# Altium project PCB_Project.PrjPcb (part 1 of 10)
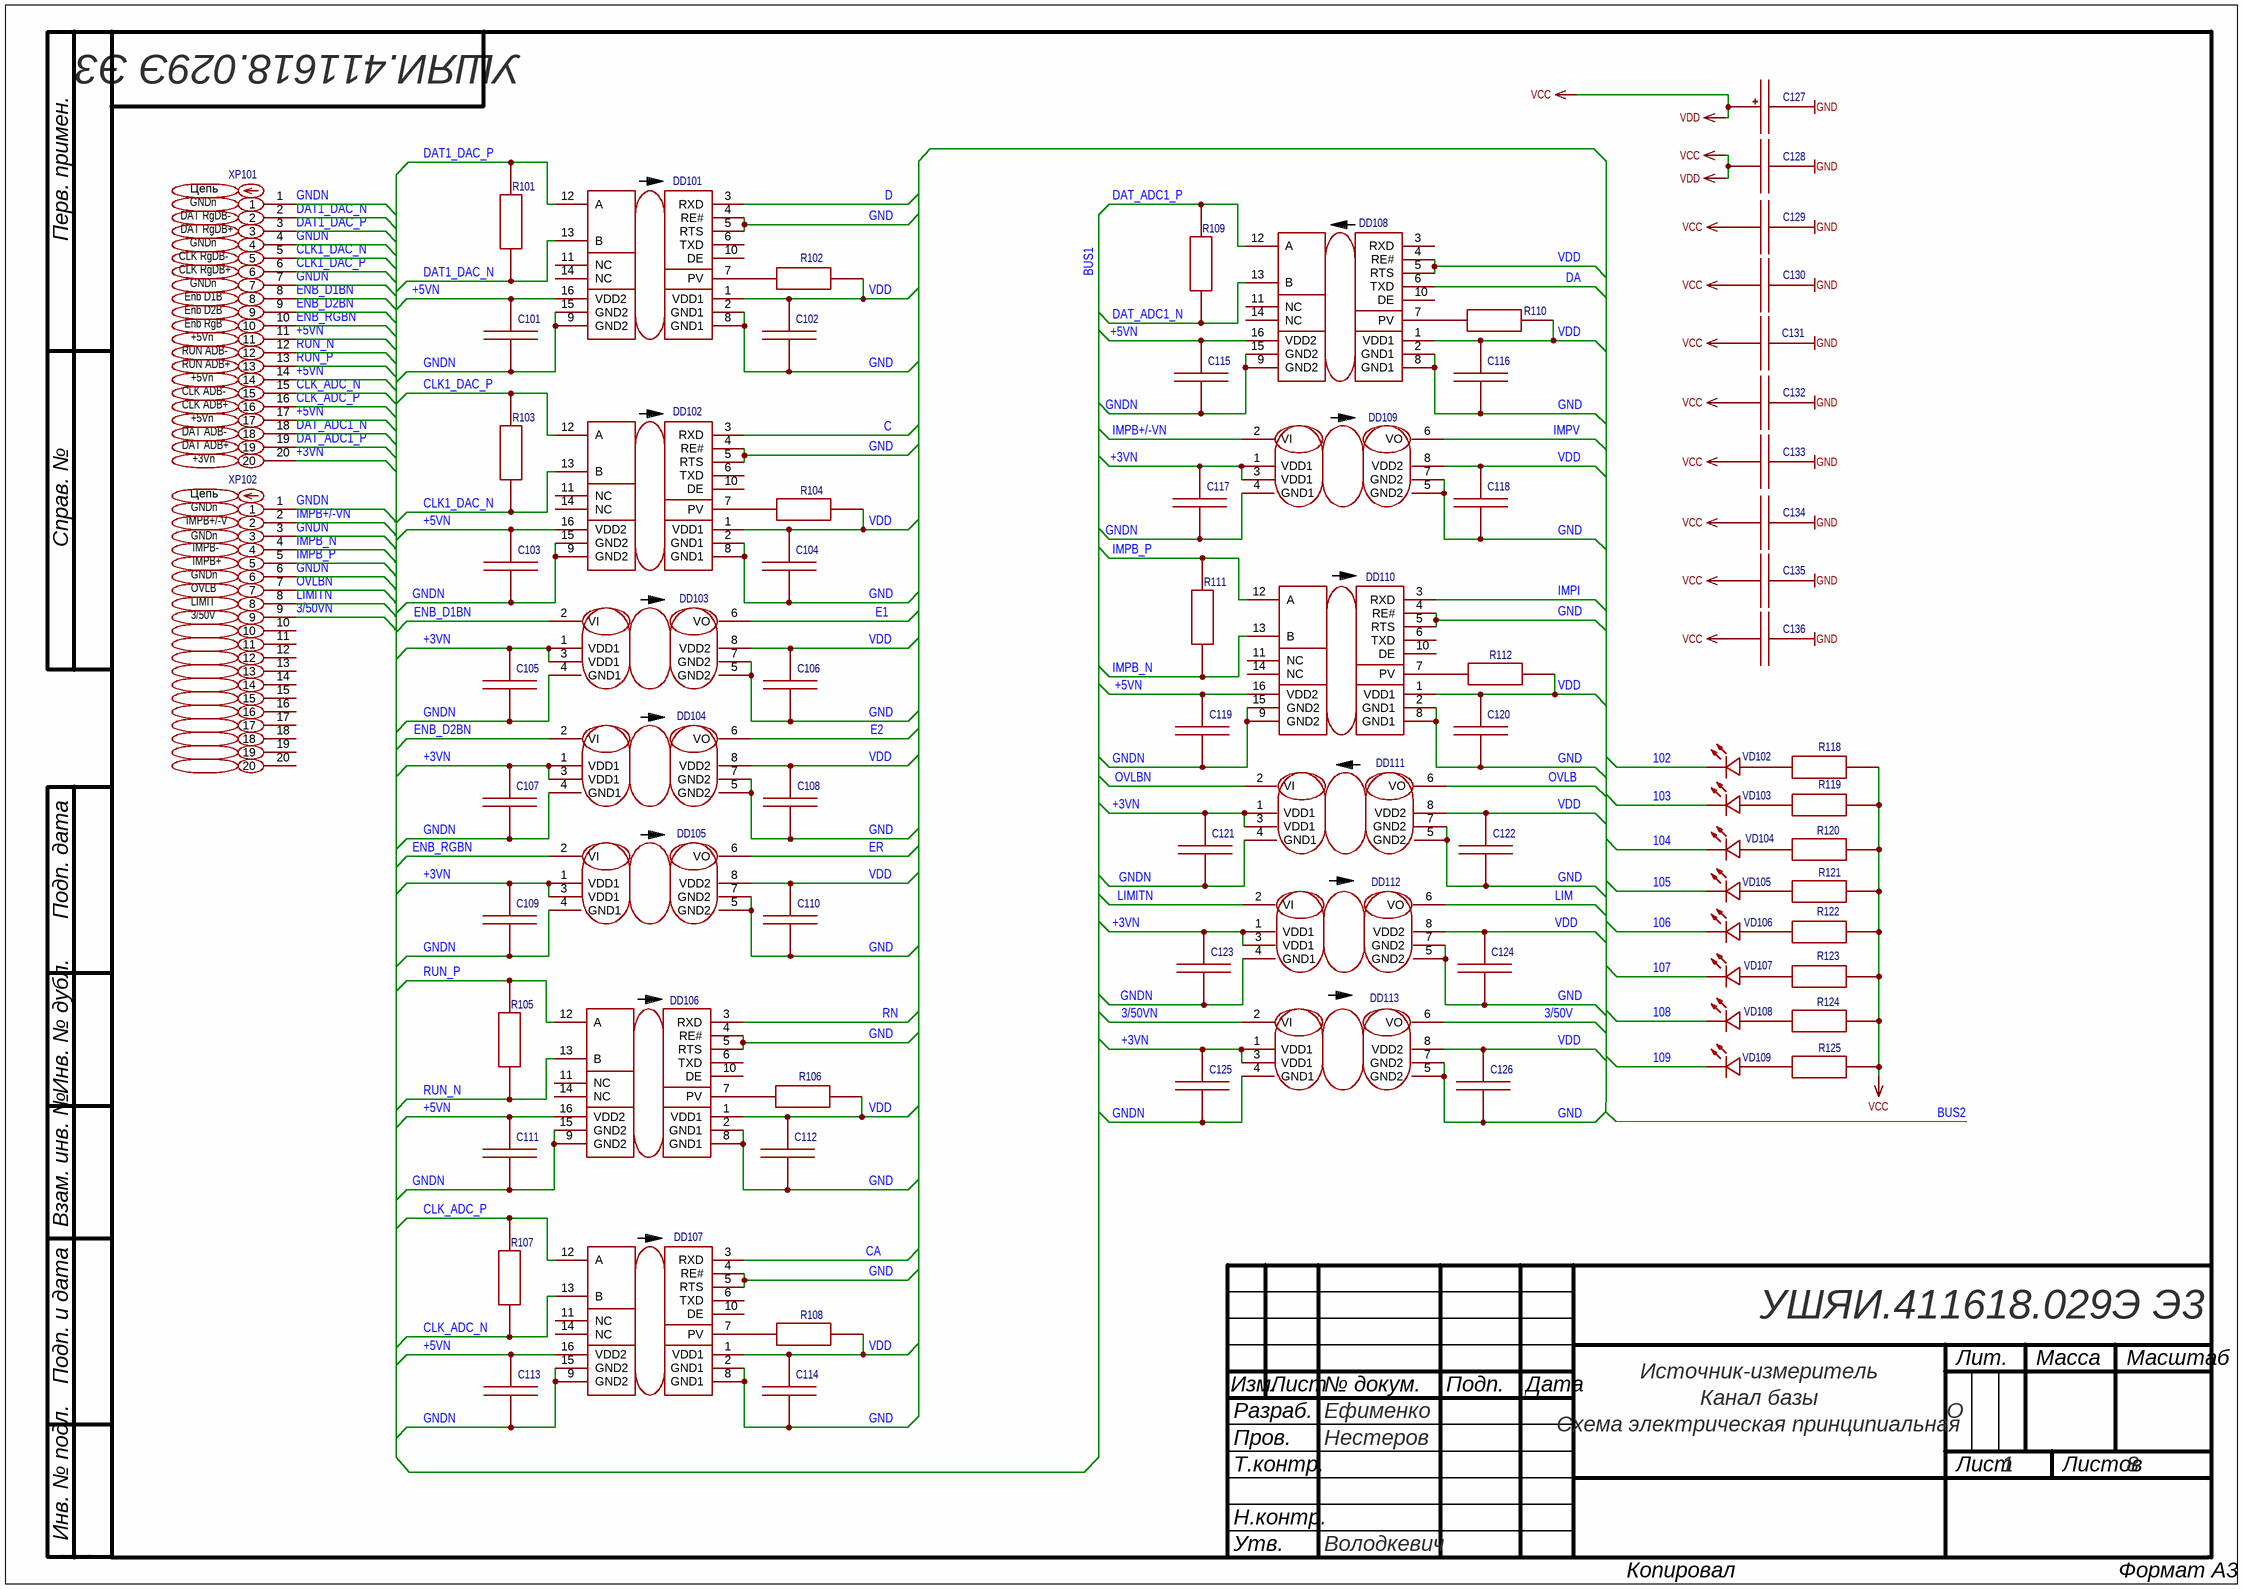
[diagram p0: УШЯИ.411618.029Э Э3 Лист 1.schdoc]
Литера: О; Наименование1: Источник-измеритель; Наименование2: Канал базы; Наименование3: Схема электрическая принципиальная; Обозначение_Код: УШЯИ.411618.029Э Э3; п_Пров_Р: Нестеров; п_Разраб: Ефименко; п_Разраб_Р: Ефименко; п_Утв_Р: Володкевич
7 sheets, 562 parts. Net scope: global (net labels, ports and power ports of the same name join across sheets).
Board file: УШЯИ.411618.029Э.pcbdoc
Sheets:
  УШЯИ.411618.029Э Э3 Лист 1.schdoc
  УШЯИ.411618.029Э Э3 Лист 2.schdoc
  УШЯИ.411618.029Э Э3 Лист 3.schdoc
  УШЯИ.411618.029Э Э3 Лист 4.schdoc
  УШЯИ.411618.029Э Э3 Лист 5.schdoc
  УШЯИ.411618.029Э Э3 Лист 6.schdoc
  УШЯИ.411618.029Э Э3 Лист 7.schdoc

## Sheet УШЯИ.411618.029Э Э3 Лист 1.schdoc
size 420 x 297 mm; ApprovedBy: Володкевич; CheckedBy: Нестеров; Author: Ефименко; CompanyName: ОАО "МНИПИ"; DrawnBy: Ефименко; Engineer: Ефименко; Organization: ОАО "МНИПИ"; DocumentNumber: УШЯИ.411618.029Э; SheetNumber: 1; SheetTotal: 8

### Parts
C101  Конденсатор SMD 100нФ 100В X7R 10% [0805]  [C0805]  (value not drawn)
C102  Конденсатор SMD 100нФ 100В X7R 10% [0805]  [C0805]  (value not drawn)
C103  Конденсатор SMD 100нФ 100В X7R 10% [0805]  [C0805]  (value not drawn)
C104  Конденсатор SMD 100нФ 100В X7R 10% [0805]  [C0805]  (value not drawn)
C105  Конденсатор SMD 100нФ 100В X7R 10% [0805]  [C0805]  (value not drawn)
C106  Конденсатор SMD 100нФ 100В X7R 10% [0805]  [C0805]  (value not drawn)
C107  Конденсатор SMD 100нФ 100В X7R 10% [0805]  [C0805]  (value not drawn)
C108  Конденсатор SMD 100нФ 100В X7R 10% [0805]  [C0805]  (value not drawn)
C109  Конденсатор SMD 100нФ 100В X7R 10% [0805]  [C0805]  (value not drawn)
C110  Конденсатор SMD 100нФ 100В X7R 10% [0805]  [C0805]  (value not drawn)
C111  Конденсатор SMD 100нФ 100В X7R 10% [0805]  [C0805]  (value not drawn)
C112  Конденсатор SMD 100нФ 100В X7R 10% [0805]  [C0805]  (value not drawn)
C113  Конденсатор SMD 100нФ 100В X7R 10% [0805]  [C0805]  (value not drawn)
C114  Конденсатор SMD 100нФ 100В X7R 10% [0805]  [C0805]  (value not drawn)
C115  Конденсатор SMD 100нФ 100В X7R 10% [0805]  [C0805]  (value not drawn)
C116  Конденсатор SMD 100нФ 100В X7R 10% [0805]  [C0805]  (value not drawn)
C117  Конденсатор SMD 100нФ 100В X7R 10% [0805]  [C0805]  (value not drawn)
C118  Конденсатор SMD 100нФ 100В X7R 10% [0805]  [C0805]  (value not drawn)
C119  Конденсатор SMD 100нФ 100В X7R 10% [0805]  [C0805]  (value not drawn)
C120  Конденсатор SMD 100нФ 100В X7R 10% [0805]  [C0805]  (value not drawn)
C121  Конденсатор SMD 100нФ 100В X7R 10% [0805]  [C0805]  (value not drawn)
C122  Конденсатор SMD 100нФ 100В X7R 10% [0805]  [C0805]  (value not drawn)
C123  Конденсатор SMD 100нФ 100В X7R 10% [0805]  [C0805]  (value not drawn)
C124  Конденсатор SMD 100нФ 100В X7R 10% [0805]  [C0805]  (value not drawn)
C125  Конденсатор SMD 100нФ 100В X7R 10% [0805]  [C0805]  (value not drawn)
C126  Конденсатор SMD 100нФ 100В X7R 10% [0805]  [C0805]  (value not drawn)
C127  TECAP, 100мкФ, 10В, тип C  [CASE-C_6032]  (value not drawn)
C128  Конденсатор SMD 10мкФ 100В X7R 10% [0805]  [C0805]  (value not drawn)
C129  Конденсатор SMD 100нФ 100В X7R 10% [0805]  [C0805]  (value not drawn)
C130  Конденсатор SMD 100нФ 100В X7R 10% [0805]  [C0805]  (value not drawn)
C131  Конденсатор SMD 100нФ 100В X7R 10% [0805]  [C0805]  (value not drawn)
C132  Конденсатор SMD 100нФ 100В X7R 10% [0805]  [C0805]  (value not drawn)
C133  Конденсатор SMD 100нФ 100В X7R 10% [0805]  [C0805]  (value not drawn)
C134  Конденсатор SMD 100нФ 100В X7R 10% [0805]  [C0805]  (value not drawn)
C135  Конденсатор SMD 100нФ 100В X7R 10% [0805]  [C0805]  (value not drawn)
C136  Конденсатор SMD 100нФ 100В X7R 10% [0805]  [C0805]  (value not drawn)
DD101  Изолированный приемопередатчик ADM2486BRWZ-REEL [SOIC-16]  [SOIC-16_L10.3-W7.5-P1.27-LS10.3-BL]  (value not drawn)
DD102  Изолированный приемопередатчик ADM2486BRWZ-REEL [SOIC-16]  [SOIC-16_L10.3-W7.5-P1.27-LS10.3-BL]  (value not drawn)
DD103  Высокоскоростной цифровой изолятор ADUM1100BRZ-RL7 [SOIC-8]  [SOIC-8_L4.9-W3.9-P1.27-LS6.0-BL]  (value not drawn)
DD104  Высокоскоростной цифровой изолятор ADUM1100BRZ-RL7 [SOIC-8]  [SOIC-8_L4.9-W3.9-P1.27-LS6.0-BL]  (value not drawn)
DD105  Высокоскоростной цифровой изолятор ADUM1100BRZ-RL7 [SOIC-8]  [SOIC-8_L4.9-W3.9-P1.27-LS6.0-BL]  (value not drawn)
DD106  Изолированный приемопередатчик ADM2486BRWZ-REEL [SOIC-16]  [SOIC-16_L10.3-W7.5-P1.27-LS10.3-BL]  (value not drawn)
DD107  Изолированный приемопередатчик ADM2486BRWZ-REEL [SOIC-16]  [SOIC-16_L10.3-W7.5-P1.27-LS10.3-BL]  (value not drawn)
DD108  Изолированный приемопередатчик ADM2486BRWZ-REEL [SOIC-16]  [SOIC-16_L10.3-W7.5-P1.27-LS10.3-BL]  (value not drawn)
DD109  Высокоскоростной цифровой изолятор ADUM1100BRZ-RL7 [SOIC-8]  [SOIC-8_L4.9-W3.9-P1.27-LS6.0-BL]  (value not drawn)
DD110  Изолированный приемопередатчик ADM2486BRWZ-REEL [SOIC-16]  [SOIC-16_L10.3-W7.5-P1.27-LS10.3-BL]  (value not drawn)
DD111  Высокоскоростной цифровой изолятор ADUM1100BRZ-RL7 [SOIC-8]  [SOIC-8_L4.9-W3.9-P1.27-LS6.0-BL]  (value not drawn)
DD112  Высокоскоростной цифровой изолятор ADUM1100BRZ-RL7 [SOIC-8]  [SOIC-8_L4.9-W3.9-P1.27-LS6.0-BL]  (value not drawn)
DD113  Высокоскоростной цифровой изолятор ADUM1100BRZ-RL7 [SOIC-8]  [SOIC-8_L4.9-W3.9-P1.27-LS6.0-BL]  (value not drawn)
R101  Резистор 100Ом 0,125Вт 1% [0805]  [R0805]  (value not drawn)
R102  Резистор 12кОм 0,125Вт 1% [0805]  [R0805]  (value not drawn)
R103  Резистор 100Ом 0,125Вт 1% [0805]  [R0805]  (value not drawn)
R104  Резистор 12кОм 0,125Вт 1% [0805]  [R0805]  (value not drawn)
R105  Резистор 100Ом 0,125Вт 1% [0805]  [R0805]  (value not drawn)
R106  Резистор 12кОм 0,125Вт 1% [0805]  [R0805]  (value not drawn)
R107  Резистор 100Ом 0,125Вт 1% [0805]  [R0805]  (value not drawn)
R108  Резистор 12кОм 0,125Вт 1% [0805]  [R0805]  (value not drawn)
R109  Резистор 100Ом 0,125Вт 1% [0805]  [R0805]  (value not drawn)
R110  Резистор 12кОм 0,125Вт 1% [0805]  [R0805]  (value not drawn)
R111  Резистор 100Ом 0,125Вт 1% [0805]  [R0805]  (value not drawn)
R112  Резистор 12кОм 0,125Вт 1% [0805]  [R0805]  (value not drawn)
R118  Резистор 100Ом 0,125Вт 1% [0805]  [R0805]  (value not drawn)
R119  Резистор 100Ом 0,125Вт 1% [0805]  [R0805]  (value not drawn)
R120  Резистор 100Ом 0,125Вт 1% [0805]  [R0805]  (value not drawn)
R121  Резистор 100Ом 0,125Вт 1% [0805]  [R0805]  (value not drawn)
R122  Резистор 100Ом 0,125Вт 1% [0805]  [R0805]  (value not drawn)
R123  Резистор 100Ом 0,125Вт 1% [0805]  [R0805]  (value not drawn)
R124  Резистор 100Ом 0,125Вт 1% [0805]  [R0805]  (value not drawn)
R125  Резистор 100Ом 0,125Вт 1% [0805]  [R0805]  (value not drawn)
VD102  Светодиод FYLS-0805GC [0805]  [FYLS-0805GC]  (value not drawn)
VD103  Светодиод FYLS-0805GC [0805]  [FYLS-0805GC]  (value not drawn)
VD104  Светодиод FYLS-0805GC [0805]  [FYLS-0805GC]  (value not drawn)
VD105  Светодиод FYLS-0805GC [0805]  [FYLS-0805GC]  (value not drawn)
VD106  Светодиод FYLS-0805GC [0805]  [FYLS-0805GC]  (value not drawn)
VD107  Светодиод FYLS-0805GC [0805]  [FYLS-0805GC]  (value not drawn)
VD108  Светодиод FYLS-0805GC [0805]  [FYLS-0805GC]  (value not drawn)
VD109  Светодиод FYLS-0805GC [0805]  [FYLS-0805GC]  (value not drawn)
XP101  Вилка на плату прямая BH2-20 (DS1014-20SF1B-B) 20pin шаг 2.00мм  [CONN-TH_20P-P2.00_DS1014-20SF1B]  (value not drawn)
XP102  Вилка на плату прямая BH2-20 (DS1014-20SF1B-B) 20pin шаг 2.00мм  [CONN-TH_20P-P2.00_DS1014-20SF1B]  (value not drawn)

### Nets
GND: C102.1 C104.1 C106.1 C108.1 C110.1 C112.1 C114.1 C116.1 C118.1 C120.1 C122.1 C124.1 C126.1 C127.2 C128.1 C129.2 C130.2 C131.2 C132.2 C133.2 C134.2 C135.2 C136.2 DD101.2(GND1) DD101.4(RE#) DD101.5(RTS) DD101.8(GND1) DD102.2(GND1) DD102.4(RE#) DD102.5(RTS) DD102.8(GND1) DD103.5(GND2) DD103.7(GND2) DD104.5(GND2) DD104.7(GND2) DD105.5(GND2) DD105.7(GND2) DD106.2(GND1) DD106.4(RE#) DD106.5(RTS) DD106.8(GND1) DD107.2(GND1) DD107.4(RE#) DD107.5(RTS) DD107.8(GND1) DD108.2(GND1) DD108.8(GND1) DD109.5(GND2) DD109.7(GND2) DD110.2(GND1) DD110.4(RE#) DD110.5(RTS) DD110.8(GND1) DD111.5(GND2) DD111.7(GND2) DD112.5(GND2) DD112.7(GND2) DD113.5(GND2) DD113.7(GND2)
VDD: C102.2 C104.2 C106.2 C108.2 C110.2 C112.2 C114.2 C116.2 C118.2 C120.2 C122.2 C124.2 C126.2 C127.1 C128.2 C129.1 C130.1 C131.1 C132.1 C133.1 C134.1 C135.1 C136.1 DD101.1(VDD1) DD102.1(VDD1) DD103.8(VDD2) DD104.8(VDD2) DD105.8(VDD2) DD106.1(VDD1) DD107.1(VDD1) DD108.1(VDD1) DD108.4(RE#) DD108.5(RTS) DD109.8(VDD2) DD110.1(VDD1) DD111.8(VDD2) DD112.8(VDD2) DD113.8(VDD2) R102.1 R104.1 R106.1 R108.1 R110.1 R112.1 R118.1 R119.1 R120.1 R121.1 R122.1 R123.1 R124.1 R125.1  [also labelled VCC]
3/50V: DD113.6(VO)
3/50VN: DD113.2(VI) XP102.9
102: VD102.1(K)
103: VD103.1(K)
104: VD104.1(K)
105: VD105.1(K)
106: VD106.1(K)
107: VD107.1(K)
108: VD108.1(K)
109: VD109.1(K)
+3VN: C105.2 C107.2 C109.2 C117.2 C121.2 C123.2 C125.2 DD103.1(VDD1) DD103.3(VDD1) DD104.1(VDD1) DD104.3(VDD1) DD105.1(VDD1) DD105.3(VDD1) DD109.1(VDD1) DD109.3(VDD1) DD111.1(VDD1) DD111.3(VDD1) DD112.1(VDD1) DD112.3(VDD1) DD113.1(VDD1) DD113.3(VDD1) XP101.20
+5VN: C101.2 C103.2 C111.2 C113.2 C115.2 C119.2 DD101.16(VDD2) DD102.16(VDD2) DD106.16(VDD2) DD107.16(VDD2) DD108.16(VDD2) DD110.16(VDD2) XP101.11 XP101.14 XP101.17
C: DD102.3(RXD)
CA: DD107.3(RXD)
CLK1_DAC_N: DD102.13(B) R103.2 XP101.5
CLK1_DAC_P: DD102.12(A) R103.1 XP101.6
CLK_ADC_N: DD107.13(B) R107.2 XP101.15
CLK_ADC_P: DD107.12(A) R107.1 XP101.16
D: DD101.3(RXD)
DA: DD108.6(TXD)
DAT1_DAC_N: DD101.13(B) R101.2 XP101.2
DAT1_DAC_P: DD101.12(A) R101.1 XP101.3
DAT_ADC1_N: DD108.13(B) R109.2 XP101.18
DAT_ADC1_P: DD108.12(A) R109.1 XP101.19
E1: DD103.6(VO)
E2: DD104.6(VO)
ENB_D1BN: DD103.2(VI) XP101.8
ENB_D2BN: DD104.2(VI) XP101.9
ENB_RGBN: DD105.2(VI) XP101.10
ER: DD105.6(VO)
GNDN: C101.1 C103.1 C105.1 C107.1 C109.1 C111.1 C113.1 C115.1 C117.1 C119.1 C121.1 C123.1 C125.1 DD101.9(GND2) DD101.15(GND2) DD102.9(GND2) DD102.15(GND2) DD103.4(GND1) DD104.4(GND1) DD105.4(GND1) DD106.9(GND2) DD106.15(GND2) DD107.9(GND2) DD107.15(GND2) DD108.9(GND2) DD108.15(GND2) DD109.4(GND1) DD110.9(GND2) DD110.15(GND2) DD111.4(GND1) DD112.4(GND1) DD113.4(GND1) XP101.1 XP101.4 XP101.7 XP102.1 XP102.3 XP102.6
IMPB+/-VN: DD109.2(VI) XP102.2
IMPB_N: DD110.13(B) R111.2 XP102.4
IMPB_P: DD110.12(A) R111.1 XP102.5
IMPI: DD110.3(RXD)
IMPV: DD109.6(VO)
LIM: DD112.6(VO)
LIMITN: DD112.2(VI) XP102.8
OVLB: DD111.6(VO)
OVLBN: DD111.2(VI) XP102.7
RN: DD106.3(RXD)
RUN_N: DD106.13(B) R105.2 XP101.12
RUN_P: DD106.12(A) R105.1 XP101.13
NetDD101_7: DD101.7(PV) R102.2
NetDD102_7: DD102.7(PV) R104.2
NetDD106_7: DD106.7(PV) R106.2
NetDD107_7: DD107.7(PV) R108.2
NetDD108_7: DD108.7(PV) R110.2
NetDD110_7: DD110.7(PV) R112.2
NetR118_2: R118.2 VD102.2(A)
NetR119_2: R119.2 VD103.2(A)
NetR120_2: R120.2 VD104.2(A)
NetR121_2: R121.2 VD105.2(A)
NetR122_2: R122.2 VD106.2(A)
NetR123_2: R123.2 VD107.2(A)
NetR124_2: R124.2 VD108.2(A)
NetR125_2: R125.2 VD109.2(A)

Not connected (* = marked no-connect by the designer): DD101 6(TXD) 10(DE) 11(NC) 14(NC); DD102 6(TXD) 10(DE) 11(NC) 14(NC); DD106 6(TXD) 10(DE) 11(NC) 14(NC); DD107 6(TXD) 10(DE) 11(NC) 14(NC); DD108 3(RXD) 10(DE) 11(NC) 14(NC); DD110 6(TXD) 10(DE) 11(NC) 14(NC); XP102 10 11 12 13 14 15 16 17 18 19 20

### Buses and harness runs
bus BUS2

### Notes on the sheet
- (near XP101) CLK RgDB-
- (near XP101) DAT RgDB-
- (near XP101) DAT RgDB+
- (near XP101) GNDn
- (near XP101) CLK RgDB+
- (near XP101) Enb D1B
- (near XP101) Enb D2B
- (near XP101) Enb RgB
- (near XP101) RUN ADB-
- (near XP101) RUN ADB+
- (near XP101) CLK ADB-
- (near XP101) +5Vn
- (near XP101) CLK ADB+
- (near XP101) DAT ADB-
- (near XP101) DAT ADB+
- +3Vn
- (near XP102) IMPB+/-V
- GNDn
- (near XP102) GNDn
- (near XP102) OVLB
- (near XP102) IMPB-
- (near XP102) IMPB+
- (near XP102) LIMIT
- (near XP102) 3/50V
- Labels drawn without touching a wire or pin: BUS1
- Перв. примен.
- Справ. №
- Подп. дата
- Инв. № дубл.
- Взам. инв. №
- Подп. и дата
- Изм.
- Разраб.
- Лист
- № докум.
- Подп.
- Дата
- Лит.
- Масса
- Масштаб
- Пров.
- Т.контр.
- Листов
- Инв. № подл.
- Н.контр.
- Утв.
- ALTIUM GOSTBOM2.0 KEV
- Копировал
- Формат А3
- (in symbol Вилка на плату прямая BH2-20 (DS1014-20SF1B-B) 20pin шаг 2.00мм) Цепь

### Library data of the parts
C101 = Конденсатор SMD 100нФ 100В X7R 10% [0805]: Contributor: jordanjin; Convert to PCB: yes; UniqueId: gge50a601ba36169810; Origin Footprint: C0805; Device: Конденсатор SMD 100нФ 100В X7R 10% [0805]; Symbol: Конденсатор SMD 100нФ 100В X7R 10% [0805]; Manufacturer Part: C0805; spicePre: C; spiceSymbolName: Конденсатор SMD 100нФ 100В X7R 10% [0805]; Add into BOM: yes; FootprintName: C0805
C102 = Конденсатор SMD 100нФ 100В X7R 10% [0805]: Contributor: jordanjin; Convert to PCB: yes; UniqueId: gge94e2ea0e3b3374a7; Origin Footprint: C0805; Device: Конденсатор SMD 100нФ 100В X7R 10% [0805]; Symbol: Конденсатор SMD 100нФ 100В X7R 10% [0805]; Manufacturer Part: C0805; spicePre: C; spiceSymbolName: Конденсатор SMD 100нФ 100В X7R 10% [0805]; Add into BOM: yes; FootprintName: C0805
C103 = Конденсатор SMD 100нФ 100В X7R 10% [0805]: Contributor: jordanjin; Convert to PCB: yes; UniqueId: ggedacb5201c4a5c4e2; Origin Footprint: C0805; Device: Конденсатор SMD 100нФ 100В X7R 10% [0805]; Symbol: Конденсатор SMD 100нФ 100В X7R 10% [0805]; Manufacturer Part: C0805; spicePre: C; spiceSymbolName: Конденсатор SMD 100нФ 100В X7R 10% [0805]; Add into BOM: yes; FootprintName: C0805
C104 = Конденсатор SMD 100нФ 100В X7R 10% [0805]: Contributor: jordanjin; Convert to PCB: yes; UniqueId: gge34eda7cf9e9ee0fb; Origin Footprint: C0805; Device: Конденсатор SMD 100нФ 100В X7R 10% [0805]; Symbol: Конденсатор SMD 100нФ 100В X7R 10% [0805]; Manufacturer Part: C0805; spicePre: C; spiceSymbolName: Конденсатор SMD 100нФ 100В X7R 10% [0805]; Add into BOM: yes; FootprintName: C0805
C105 = Конденсатор SMD 100нФ 100В X7R 10% [0805]: Contributor: jordanjin; Convert to PCB: yes; UniqueId: gge25c71510294cab0d; Origin Footprint: C0805; Device: Конденсатор SMD 100нФ 100В X7R 10% [0805]; Symbol: Конденсатор SMD 100нФ 100В X7R 10% [0805]; Manufacturer Part: C0805; spicePre: C; spiceSymbolName: Конденсатор SMD 100нФ 100В X7R 10% [0805]; Add into BOM: yes; FootprintName: C0805
C106 = Конденсатор SMD 100нФ 100В X7R 10% [0805]: Contributor: jordanjin; Convert to PCB: yes; UniqueId: gge49d087e124082ea0; Origin Footprint: C0805; Device: Конденсатор SMD 100нФ 100В X7R 10% [0805]; Symbol: Конденсатор SMD 100нФ 100В X7R 10% [0805]; Manufacturer Part: C0805; spicePre: C; spiceSymbolName: Конденсатор SMD 100нФ 100В X7R 10% [0805]; Add into BOM: yes; FootprintName: C0805
C107 = Конденсатор SMD 100нФ 100В X7R 10% [0805]: Contributor: jordanjin; Convert to PCB: yes; UniqueId: gge50cb57ab95e02ebe; Origin Footprint: C0805; Device: Конденсатор SMD 100нФ 100В X7R 10% [0805]; Symbol: Конденсатор SMD 100нФ 100В X7R 10% [0805]; Manufacturer Part: C0805; spicePre: C; spiceSymbolName: Конденсатор SMD 100нФ 100В X7R 10% [0805]; Add into BOM: yes; FootprintName: C0805
C108 = Конденсатор SMD 100нФ 100В X7R 10% [0805]: Contributor: jordanjin; Convert to PCB: yes; UniqueId: gged933a6a0350d5a04; Origin Footprint: C0805; Device: Конденсатор SMD 100нФ 100В X7R 10% [0805]; Symbol: Конденсатор SMD 100нФ 100В X7R 10% [0805]; Manufacturer Part: C0805; spicePre: C; spiceSymbolName: Конденсатор SMD 100нФ 100В X7R 10% [0805]; Add into BOM: yes; FootprintName: C0805
C109 = Конденсатор SMD 100нФ 100В X7R 10% [0805]: Contributor: jordanjin; Convert to PCB: yes; UniqueId: gge27962ba85defdf79; Origin Footprint: C0805; Device: Конденсатор SMD 100нФ 100В X7R 10% [0805]; Symbol: Конденсатор SMD 100нФ 100В X7R 10% [0805]; Manufacturer Part: C0805; spicePre: C; spiceSymbolName: Конденсатор SMD 100нФ 100В X7R 10% [0805]; Add into BOM: yes; FootprintName: C0805
C110 = Конденсатор SMD 100нФ 100В X7R 10% [0805]: Contributor: jordanjin; Convert to PCB: yes; UniqueId: gge612c97588fe9464b; Origin Footprint: C0805; Device: Конденсатор SMD 100нФ 100В X7R 10% [0805]; Symbol: Конденсатор SMD 100нФ 100В X7R 10% [0805]; Manufacturer Part: C0805; spicePre: C; spiceSymbolName: Конденсатор SMD 100нФ 100В X7R 10% [0805]; Add into BOM: yes; FootprintName: C0805
C111 = Конденсатор SMD 100нФ 100В X7R 10% [0805]: Contributor: jordanjin; Convert to PCB: yes; UniqueId: gge2f7a6f25e128a448; Origin Footprint: C0805; Device: Конденсатор SMD 100нФ 100В X7R 10% [0805]; Symbol: Конденсатор SMD 100нФ 100В X7R 10% [0805]; Manufacturer Part: C0805; spicePre: C; spiceSymbolName: Конденсатор SMD 100нФ 100В X7R 10% [0805]; Add into BOM: yes; FootprintName: C0805
C112 = Конденсатор SMD 100нФ 100В X7R 10% [0805]: Contributor: jordanjin; Convert to PCB: yes; UniqueId: gge7a76c4b2d63205ed; Origin Footprint: C0805; Device: Конденсатор SMD 100нФ 100В X7R 10% [0805]; Symbol: Конденсатор SMD 100нФ 100В X7R 10% [0805]; Manufacturer Part: C0805; spicePre: C; spiceSymbolName: Конденсатор SMD 100нФ 100В X7R 10% [0805]; Add into BOM: yes; FootprintName: C0805
C113 = Конденсатор SMD 100нФ 100В X7R 10% [0805]: Contributor: jordanjin; Convert to PCB: yes; UniqueId: gge1b835d6c60b435b0; Origin Footprint: C0805; Device: Конденсатор SMD 100нФ 100В X7R 10% [0805]; Symbol: Конденсатор SMD 100нФ 100В X7R 10% [0805]; Manufacturer Part: C0805; spicePre: C; spiceSymbolName: Конденсатор SMD 100нФ 100В X7R 10% [0805]; Add into BOM: yes; FootprintName: C0805
C114 = Конденсатор SMD 100нФ 100В X7R 10% [0805]: Contributor: jordanjin; Convert to PCB: yes; UniqueId: gged3422836171095bd; Origin Footprint: C0805; Device: Конденсатор SMD 100нФ 100В X7R 10% [0805]; Symbol: Конденсатор SMD 100нФ 100В X7R 10% [0805]; Manufacturer Part: C0805; spicePre: C; spiceSymbolName: Конденсатор SMD 100нФ 100В X7R 10% [0805]; Add into BOM: yes; FootprintName: C0805
C115 = Конденсатор SMD 100нФ 100В X7R 10% [0805]: Contributor: jordanjin; Convert to PCB: yes; UniqueId: gge559d8560901f254c; Origin Footprint: C0805; Device: Конденсатор SMD 100нФ 100В X7R 10% [0805]; Symbol: Конденсатор SMD 100нФ 100В X7R 10% [0805]; Manufacturer Part: C0805; spicePre: C; spiceSymbolName: Конденсатор SMD 100нФ 100В X7R 10% [0805]; Add into BOM: yes; FootprintName: C0805
C116 = Конденсатор SMD 100нФ 100В X7R 10% [0805]: Contributor: jordanjin; Convert to PCB: yes; UniqueId: ggec511750cb831a988; Origin Footprint: C0805; Device: Конденсатор SMD 100нФ 100В X7R 10% [0805]; Symbol: Конденсатор SMD 100нФ 100В X7R 10% [0805]; Manufacturer Part: C0805; spicePre: C; spiceSymbolName: Конденсатор SMD 100нФ 100В X7R 10% [0805]; Add into BOM: yes; FootprintName: C0805
C117 = Конденсатор SMD 100нФ 100В X7R 10% [0805]: Contributor: jordanjin; Convert to PCB: yes; UniqueId: gge492dbba8a9d90766; Origin Footprint: C0805; Device: Конденсатор SMD 100нФ 100В X7R 10% [0805]; Symbol: Конденсатор SMD 100нФ 100В X7R 10% [0805]; Manufacturer Part: C0805; spicePre: C; spiceSymbolName: Конденсатор SMD 100нФ 100В X7R 10% [0805]; Add into BOM: yes; FootprintName: C0805
C118 = Конденсатор SMD 100нФ 100В X7R 10% [0805]: Contributor: jordanjin; Convert to PCB: yes; UniqueId: ggedc3a872f3d7bf9b6; Origin Footprint: C0805; Device: Конденсатор SMD 100нФ 100В X7R 10% [0805]; Symbol: Конденсатор SMD 100нФ 100В X7R 10% [0805]; Manufacturer Part: C0805; spicePre: C; spiceSymbolName: Конденсатор SMD 100нФ 100В X7R 10% [0805]; Add into BOM: yes; FootprintName: C0805
C119 = Конденсатор SMD 100нФ 100В X7R 10% [0805]: Contributor: jordanjin; Convert to PCB: yes; UniqueId: ggea50e830354660b01; Origin Footprint: C0805; Device: Конденсатор SMD 100нФ 100В X7R 10% [0805]; Symbol: Конденсатор SMD 100нФ 100В X7R 10% [0805]; Manufacturer Part: C0805; spicePre: C; spiceSymbolName: Конденсатор SMD 100нФ 100В X7R 10% [0805]; Add into BOM: yes; FootprintName: C0805
C120 = Конденсатор SMD 100нФ 100В X7R 10% [0805]: Contributor: jordanjin; Convert to PCB: yes; UniqueId: gge9590b5d8379a1919; Origin Footprint: C0805; Device: Конденсатор SMD 100нФ 100В X7R 10% [0805]; Symbol: Конденсатор SMD 100нФ 100В X7R 10% [0805]; Manufacturer Part: C0805; spicePre: C; spiceSymbolName: Конденсатор SMD 100нФ 100В X7R 10% [0805]; Add into BOM: yes; FootprintName: C0805
C121 = Конденсатор SMD 100нФ 100В X7R 10% [0805]: Contributor: jordanjin; Convert to PCB: yes; UniqueId: gge63b3ddf0ade3641d; Origin Footprint: C0805; Device: Конденсатор SMD 100нФ 100В X7R 10% [0805]; Symbol: Конденсатор SMD 100нФ 100В X7R 10% [0805]; Manufacturer Part: C0805; spicePre: C; spiceSymbolName: Конденсатор SMD 100нФ 100В X7R 10% [0805]; Add into BOM: yes; FootprintName: C0805
C122 = Конденсатор SMD 100нФ 100В X7R 10% [0805]: Contributor: jordanjin; Convert to PCB: yes; UniqueId: ggeb83b43dba428f6ef; Origin Footprint: C0805; Device: Конденсатор SMD 100нФ 100В X7R 10% [0805]; Symbol: Конденсатор SMD 100нФ 100В X7R 10% [0805]; Manufacturer Part: C0805; spicePre: C; spiceSymbolName: Конденсатор SMD 100нФ 100В X7R 10% [0805]; Add into BOM: yes; FootprintName: C0805
C123 = Конденсатор SMD 100нФ 100В X7R 10% [0805]: Contributor: jordanjin; Convert to PCB: yes; UniqueId: ggea2a125f1a1054dbe; Origin Footprint: C0805; Device: Конденсатор SMD 100нФ 100В X7R 10% [0805]; Symbol: Конденсатор SMD 100нФ 100В X7R 10% [0805]; Manufacturer Part: C0805; spicePre: C; spiceSymbolName: Конденсатор SMD 100нФ 100В X7R 10% [0805]; Add into BOM: yes; FootprintName: C0805
C124 = Конденсатор SMD 100нФ 100В X7R 10% [0805]: Contributor: jordanjin; Convert to PCB: yes; UniqueId: gge87e42572fc320fa7; Origin Footprint: C0805; Device: Конденсатор SMD 100нФ 100В X7R 10% [0805]; Symbol: Конденсатор SMD 100нФ 100В X7R 10% [0805]; Manufacturer Part: C0805; spicePre: C; spiceSymbolName: Конденсатор SMD 100нФ 100В X7R 10% [0805]; Add into BOM: yes; FootprintName: C0805
C125 = Конденсатор SMD 100нФ 100В X7R 10% [0805]: Contributor: jordanjin; Convert to PCB: yes; UniqueId: ggea9bf1272ff874ec4; Origin Footprint: C0805; Device: Конденсатор SMD 100нФ 100В X7R 10% [0805]; Symbol: Конденсатор SMD 100нФ 100В X7R 10% [0805]; Manufacturer Part: C0805; spicePre: C; spiceSymbolName: Конденсатор SMD 100нФ 100В X7R 10% [0805]; Add into BOM: yes; FootprintName: C0805
C126 = Конденсатор SMD 100нФ 100В X7R 10% [0805]: Contributor: jordanjin; Convert to PCB: yes; UniqueId: ggec79572819af15c76; Origin Footprint: C0805; Device: Конденсатор SMD 100нФ 100В X7R 10% [0805]; Symbol: Конденсатор SMD 100нФ 100В X7R 10% [0805]; Manufacturer Part: C0805; spicePre: C; spiceSymbolName: Конденсатор SMD 100нФ 100В X7R 10% [0805]; Add into BOM: yes; FootprintName: C0805
C127 = TECAP, 100мкФ, 10В, тип C: Manufacturer: Kyocera AVX; nameAlias: Value; Contributor: jordanjin; Convert to PCB: yes; UniqueId: gge1274122329830bad; Origin Footprint: CASE-C_6032; Device: TECAP, 100мкФ, 10В, тип C; Symbol: TECAP, 100мкФ, 10В, тип C; Supplier: LCSC; Supplier Part: C273664; Manufacturer Part: TECAP, 100мкФ, 10В, тип C; JLCPCB Part Class: Extended Part; spicePre: C; spiceSymbolName: TECAP, 100мкФ, 10В, тип C; Add into BOM: yes; FootprintName: CASE-C_6032
C128 = Конденсатор SMD 10мкФ 100В X7R 10% [0805]: Contributor: jordanjin; Convert to PCB: yes; UniqueId: gge114f7bd3638c32e8; Origin Footprint: C0805; Device: Конденсатор SMD 10мкФ 100В X7R 10% [0805]; Symbol: Конденсатор SMD 10мкФ 100В X7R 10% [0805]; Manufacturer Part: C0805; spicePre: C; spiceSymbolName: Конденсатор SMD 100нФ 100В X7R 10% [0805]; Add into BOM: yes; FootprintName: C0805
C129 = Конденсатор SMD 100нФ 100В X7R 10% [0805]: Contributor: jordanjin; Convert to PCB: yes; UniqueId: ggeb629d3a449f0ebd6; Origin Footprint: C0805; Device: Конденсатор SMD 100нФ 100В X7R 10% [0805]; Symbol: Конденсатор SMD 100нФ 100В X7R 10% [0805]; Manufacturer Part: C0805; spicePre: C; spiceSymbolName: Конденсатор SMD 100нФ 100В X7R 10% [0805]; Add into BOM: yes; FootprintName: C0805
C130 = Конденсатор SMD 100нФ 100В X7R 10% [0805]: Contributor: jordanjin; Convert to PCB: yes; UniqueId: gge720601326cec92c7; Origin Footprint: C0805; Device: Конденсатор SMD 100нФ 100В X7R 10% [0805]; Symbol: Конденсатор SMD 100нФ 100В X7R 10% [0805]; Manufacturer Part: C0805; spicePre: C; spiceSymbolName: Конденсатор SMD 100нФ 100В X7R 10% [0805]; Add into BOM: yes; FootprintName: C0805
C131 = Конденсатор SMD 100нФ 100В X7R 10% [0805]: Contributor: jordanjin; Convert to PCB: yes; UniqueId: gge93f31df730ba0f33; Origin Footprint: C0805; Device: Конденсатор SMD 100нФ 100В X7R 10% [0805]; Symbol: Конденсатор SMD 100нФ 100В X7R 10% [0805]; Manufacturer Part: C0805; spicePre: C; spiceSymbolName: Конденсатор SMD 100нФ 100В X7R 10% [0805]; Add into BOM: yes; FootprintName: C0805
C132 = Конденсатор SMD 100нФ 100В X7R 10% [0805]: Contributor: jordanjin; Convert to PCB: yes; UniqueId: ggeb7d0df687c6811f3; Origin Footprint: C0805; Device: Конденсатор SMD 100нФ 100В X7R 10% [0805]; Symbol: Конденсатор SMD 100нФ 100В X7R 10% [0805]; Manufacturer Part: C0805; spicePre: C; spiceSymbolName: Конденсатор SMD 100нФ 100В X7R 10% [0805]; Add into BOM: yes; FootprintName: C0805
C133 = Конденсатор SMD 100нФ 100В X7R 10% [0805]: Contributor: jordanjin; Convert to PCB: yes; UniqueId: ggeda150ecc94310c71; Origin Footprint: C0805; Device: Конденсатор SMD 100нФ 100В X7R 10% [0805]; Symbol: Конденсатор SMD 100нФ 100В X7R 10% [0805]; Manufacturer Part: C0805; spicePre: C; spiceSymbolName: Конденсатор SMD 100нФ 100В X7R 10% [0805]; Add into BOM: yes; FootprintName: C0805
C134 = Конденсатор SMD 100нФ 100В X7R 10% [0805]: Contributor: jordanjin; Convert to PCB: yes; UniqueId: gge45b133ad58b3c6cc; Origin Footprint: C0805; Device: Конденсатор SMD 100нФ 100В X7R 10% [0805]; Symbol: Конденсатор SMD 100нФ 100В X7R 10% [0805]; Manufacturer Part: C0805; spicePre: C; spiceSymbolName: Конденсатор SMD 100нФ 100В X7R 10% [0805]; Add into BOM: yes; FootprintName: C0805
C135 = Конденсатор SMD 100нФ 100В X7R 10% [0805]: Contributor: jordanjin; Convert to PCB: yes; UniqueId: gge8cfa1b9352ccbfc1; Origin Footprint: C0805; Device: Конденсатор SMD 100нФ 100В X7R 10% [0805]; Symbol: Конденсатор SMD 100нФ 100В X7R 10% [0805]; Manufacturer Part: C0805; spicePre: C; spiceSymbolName: Конденсатор SMD 100нФ 100В X7R 10% [0805]; Add into BOM: yes; FootprintName: C0805
C136 = Конденсатор SMD 100нФ 100В X7R 10% [0805]: Contributor: jordanjin; Convert to PCB: yes; UniqueId: gge177eba0eb34f5c30; Origin Footprint: C0805; Device: Конденсатор SMD 100нФ 100В X7R 10% [0805]; Symbol: Конденсатор SMD 100нФ 100В X7R 10% [0805]; Manufacturer Part: C0805; spicePre: C; spiceSymbolName: Конденсатор SMD 100нФ 100В X7R 10% [0805]; Add into BOM: yes; FootprintName: C0805
DD101 = Изолированный приемопередатчик ADM2486BRWZ-REEL [SOIC-16]: Manufacturer: Analog Devices; Contributor: jordanjin; Convert to PCB: yes; UniqueId: gge280670cf599e4aa0; Origin Footprint: SOIC-16_L10.3-W7.5-P1.27-LS10.3-BL; Device: Изолированный приемопередатчик ADM2486BRWZ-REEL [SOIC-16]; Symbol: Изолированный приемопередатчик ADM2486BRWZ-REEL [SOIC-16]; Supplier: LCSC; Manufacturer Part: ADM2486BRWZ-REEL; JLCPCB Part Class: Extended Part; spicePre: D; spiceSymbolName: ADM2486BRWZ-REEL; Add into BOM: yes; FootprintName: SOIC-16_L10.3-W7.5-P1.27-LS10.3-BL
DD102 = Изолированный приемопередатчик ADM2486BRWZ-REEL [SOIC-16]: Manufacturer: Analog Devices; Contributor: jordanjin; Convert to PCB: yes; UniqueId: ggee281b66250e43b86; Origin Footprint: SOIC-16_L10.3-W7.5-P1.27-LS10.3-BL; Device: Изолированный приемопередатчик ADM2486BRWZ-REEL [SOIC-16]; Symbol: Изолированный приемопередатчик ADM2486BRWZ-REEL [SOIC-16]; Supplier: LCSC; Manufacturer Part: ADM2486BRWZ-REEL; JLCPCB Part Class: Extended Part; spicePre: D; spiceSymbolName: ADM2486BRWZ-REEL; Add into BOM: yes; FootprintName: SOIC-16_L10.3-W7.5-P1.27-LS10.3-BL
DD103 = Высокоскоростной цифровой изолятор ADUM1100BRZ-RL7 [SOIC-8]: Manufacturer: Analog Devices; Manufacturer Part: ADUM1100ARZ; Contributor: jordanjin; Convert to PCB: yes; UniqueId: gged390e51bf4fd7430; Origin Footprint: SOIC-8_L4.9-W3.9-P1.27-LS6.0-BL; Device: Высокоскоростной цифровой изолятор ADUM1100BRZ-RL7 [SOIC-8]; Symbol: Высокоскоростной цифровой изолятор ADUM1100BRZ-RL7 [SOIC-8]; Supplier: LCSC; JLCPCB Part Class: Extended Part; spicePre: D; spiceSymbolName: Высокоскоростной цифровой изолятор ADUM1100BRZ-RL7 [SOIC-8]; Add into BOM: yes; FootprintName: SOIC-8_L4.9-W3.9-P1.27-LS6.0-BL
DD104 = Высокоскоростной цифровой изолятор ADUM1100BRZ-RL7 [SOIC-8]: Manufacturer: Analog Devices; Manufacturer Part: ADUM1100ARZ; Contributor: jordanjin; Convert to PCB: yes; UniqueId: ggefa5c6f2ce462c50e; Origin Footprint: SOIC-8_L4.9-W3.9-P1.27-LS6.0-BL; Device: Высокоскоростной цифровой изолятор ADUM1100BRZ-RL7 [SOIC-8]; Symbol: Высокоскоростной цифровой изолятор ADUM1100BRZ-RL7 [SOIC-8]; Supplier: LCSC; JLCPCB Part Class: Extended Part; spicePre: D; spiceSymbolName: Высокоскоростной цифровой изолятор ADUM1100BRZ-RL7 [SOIC-8]; Add into BOM: yes; FootprintName: SOIC-8_L4.9-W3.9-P1.27-LS6.0-BL
DD105 = Высокоскоростной цифровой изолятор ADUM1100BRZ-RL7 [SOIC-8]: Manufacturer: Analog Devices; Manufacturer Part: ADUM1100ARZ; Contributor: jordanjin; Convert to PCB: yes; UniqueId: gge7937ef05f563b8cc; Origin Footprint: SOIC-8_L4.9-W3.9-P1.27-LS6.0-BL; Device: Высокоскоростной цифровой изолятор ADUM1100BRZ-RL7 [SOIC-8]; Symbol: Высокоскоростной цифровой изолятор ADUM1100BRZ-RL7 [SOIC-8]; Supplier: LCSC; JLCPCB Part Class: Extended Part; spicePre: D; spiceSymbolName: Высокоскоростной цифровой изолятор ADUM1100BRZ-RL7 [SOIC-8]; Add into BOM: yes; FootprintName: SOIC-8_L4.9-W3.9-P1.27-LS6.0-BL
DD106 = Изолированный приемопередатчик ADM2486BRWZ-REEL [SOIC-16]: Manufacturer: Analog Devices; Contributor: jordanjin; Convert to PCB: yes; UniqueId: gge233945d82e3d21a8; Origin Footprint: SOIC-16_L10.3-W7.5-P1.27-LS10.3-BL; Device: Изолированный приемопередатчик ADM2486BRWZ-REEL [SOIC-16]; Symbol: Изолированный приемопередатчик ADM2486BRWZ-REEL [SOIC-16]; Supplier: LCSC; Manufacturer Part: ADM2486BRWZ-REEL; JLCPCB Part Class: Extended Part; spicePre: D; spiceSymbolName: ADM2486BRWZ-REEL; Add into BOM: yes; FootprintName: SOIC-16_L10.3-W7.5-P1.27-LS10.3-BL
DD107 = Изолированный приемопередатчик ADM2486BRWZ-REEL [SOIC-16]: Manufacturer: Analog Devices; Contributor: jordanjin; Convert to PCB: yes; UniqueId: ggebc0a98823a54ad10; Origin Footprint: SOIC-16_L10.3-W7.5-P1.27-LS10.3-BL; Device: Изолированный приемопередатчик ADM2486BRWZ-REEL [SOIC-16]; Symbol: Изолированный приемопередатчик ADM2486BRWZ-REEL [SOIC-16]; Supplier: LCSC; Manufacturer Part: ADM2486BRWZ-REEL; JLCPCB Part Class: Extended Part; spicePre: D; spiceSymbolName: ADM2486BRWZ-REEL; Add into BOM: yes; FootprintName: SOIC-16_L10.3-W7.5-P1.27-LS10.3-BL
DD108 = Изолированный приемопередатчик ADM2486BRWZ-REEL [SOIC-16]: Manufacturer: Analog Devices; Contributor: jordanjin; Convert to PCB: yes; UniqueId: gge3fd088e38cfc0ffe; Origin Footprint: SOIC-16_L10.3-W7.5-P1.27-LS10.3-BL; Device: Изолированный приемопередатчик ADM2486BRWZ-REEL [SOIC-16]; Symbol: Изолированный приемопередатчик ADM2486BRWZ-REEL [SOIC-16]; Supplier: LCSC; Manufacturer Part: ADM2486BRWZ-REEL; JLCPCB Part Class: Extended Part; spicePre: D; spiceSymbolName: ADM2486BRWZ-REEL; Add into BOM: yes; FootprintName: SOIC-16_L10.3-W7.5-P1.27-LS10.3-BL
DD109 = Высокоскоростной цифровой изолятор ADUM1100BRZ-RL7 [SOIC-8]: Manufacturer: Analog Devices; Manufacturer Part: ADUM1100ARZ; Contributor: jordanjin; Convert to PCB: yes; UniqueId: gge02d54f2b020cfd78; Origin Footprint: SOIC-8_L4.9-W3.9-P1.27-LS6.0-BL; Device: Высокоскоростной цифровой изолятор ADUM1100BRZ-RL7 [SOIC-8]; Symbol: Высокоскоростной цифровой изолятор ADUM1100BRZ-RL7 [SOIC-8]; Supplier: LCSC; JLCPCB Part Class: Extended Part; spicePre: D; spiceSymbolName: Высокоскоростной цифровой изолятор ADUM1100BRZ-RL7 [SOIC-8]; Add into BOM: yes; FootprintName: SOIC-8_L4.9-W3.9-P1.27-LS6.0-BL
DD110 = Изолированный приемопередатчик ADM2486BRWZ-REEL [SOIC-16]: Manufacturer: Analog Devices; Contributor: jordanjin; Convert to PCB: yes; UniqueId: gge7962ba2743f0d233; Origin Footprint: SOIC-16_L10.3-W7.5-P1.27-LS10.3-BL; Device: Изолированный приемопередатчик ADM2486BRWZ-REEL [SOIC-16]; Symbol: Изолированный приемопередатчик ADM2486BRWZ-REEL [SOIC-16]; Supplier: LCSC; Manufacturer Part: ADM2486BRWZ-REEL; JLCPCB Part Class: Extended Part; spicePre: D; spiceSymbolName: ADM2486BRWZ-REEL; Add into BOM: yes; FootprintName: SOIC-16_L10.3-W7.5-P1.27-LS10.3-BL
DD111 = Высокоскоростной цифровой изолятор ADUM1100BRZ-RL7 [SOIC-8]: Manufacturer: Analog Devices; Manufacturer Part: ADUM1100ARZ; Contributor: jordanjin; Convert to PCB: yes; UniqueId: gge672aa3b78a0e2831; Origin Footprint: SOIC-8_L4.9-W3.9-P1.27-LS6.0-BL; Device: Высокоскоростной цифровой изолятор ADUM1100BRZ-RL7 [SOIC-8]; Symbol: Высокоскоростной цифровой изолятор ADUM1100BRZ-RL7 [SOIC-8]; Supplier: LCSC; JLCPCB Part Class: Extended Part; spicePre: D; spiceSymbolName: Высокоскоростной цифровой изолятор ADUM1100BRZ-RL7 [SOIC-8]; Add into BOM: yes; FootprintName: SOIC-8_L4.9-W3.9-P1.27-LS6.0-BL
DD112 = Высокоскоростной цифровой изолятор ADUM1100BRZ-RL7 [SOIC-8]: Manufacturer: Analog Devices; Manufacturer Part: ADUM1100ARZ; Contributor: jordanjin; Convert to PCB: yes; UniqueId: gge049ba3f92aabc7b6; Origin Footprint: SOIC-8_L4.9-W3.9-P1.27-LS6.0-BL; Device: Высокоскоростной цифровой изолятор ADUM1100BRZ-RL7 [SOIC-8]; Symbol: Высокоскоростной цифровой изолятор ADUM1100BRZ-RL7 [SOIC-8]; Supplier: LCSC; JLCPCB Part Class: Extended Part; spicePre: D; spiceSymbolName: Высокоскоростной цифровой изолятор ADUM1100BRZ-RL7 [SOIC-8]; Add into BOM: yes; FootprintName: SOIC-8_L4.9-W3.9-P1.27-LS6.0-BL
DD113 = Высокоскоростной цифровой изолятор ADUM1100BRZ-RL7 [SOIC-8]: Manufacturer: Analog Devices; Manufacturer Part: ADUM1100ARZ; Contributor: jordanjin; Convert to PCB: yes; UniqueId: gge467b7f9dac9089db; Origin Footprint: SOIC-8_L4.9-W3.9-P1.27-LS6.0-BL; Device: Высокоскоростной цифровой изолятор ADUM1100BRZ-RL7 [SOIC-8]; Symbol: Высокоскоростной цифровой изолятор ADUM1100BRZ-RL7 [SOIC-8]; Supplier: LCSC; JLCPCB Part Class: Extended Part; spicePre: D; spiceSymbolName: Высокоскоростной цифровой изолятор ADUM1100BRZ-RL7 [SOIC-8]; Add into BOM: yes; FootprintName: SOIC-8_L4.9-W3.9-P1.27-LS6.0-BL
R101 = Резистор 100Ом 0,125Вт 1% [0805]: Contributor: jordanjin; Convert to PCB: yes; UniqueId: gge8e69174dfe8de139; ModelId: de27d504f5024d53a3020ec2611f5e5e; Origin Footprint: R0805; Device: Резистор 100Ом 0,125Вт 1% [0805]; Symbol: Резистор 100Ом 0,125Вт 1% [0805]; Manufacturer Part: R0805; spicePre: R; spiceSymbolName: Резистор 12кОм 0,125Вт 1% [0805]; Add into BOM: yes; FootprintName: R0805; ModelName: R0805
R102 = Резистор 12кОм 0,125Вт 1% [0805]: Contributor: jordanjin; Convert to PCB: yes; UniqueId: gge3593b5a987344394; ModelId: de27d504f5024d53a3020ec2611f5e5e; Origin Footprint: R0805; Device: Резистор 12кОм 0,125Вт 1% [0805]; Symbol: Резистор 12кОм 0,125Вт 1% [0805]; Manufacturer Part: R0805; spicePre: R; spiceSymbolName: Резистор 12кОм 0,125Вт 1% [0805]; Add into BOM: yes; FootprintName: R0805; ModelName: R0805
R103 = Резистор 100Ом 0,125Вт 1% [0805]: Contributor: jordanjin; Convert to PCB: yes; UniqueId: ggea83a839db35ba597; ModelId: de27d504f5024d53a3020ec2611f5e5e; Origin Footprint: R0805; Device: Резистор 100Ом 0,125Вт 1% [0805]; Symbol: Резистор 100Ом 0,125Вт 1% [0805]; Manufacturer Part: R0805; spicePre: R; spiceSymbolName: Резистор 12кОм 0,125Вт 1% [0805]; Add into BOM: yes; FootprintName: R0805; ModelName: R0805
R104 = Резистор 12кОм 0,125Вт 1% [0805]: Contributor: jordanjin; Convert to PCB: yes; UniqueId: gge34205e959e161e99; ModelId: de27d504f5024d53a3020ec2611f5e5e; Origin Footprint: R0805; Device: Резистор 12кОм 0,125Вт 1% [0805]; Symbol: Резистор 12кОм 0,125Вт 1% [0805]; Manufacturer Part: R0805; spicePre: R; spiceSymbolName: Резистор 12кОм 0,125Вт 1% [0805]; Add into BOM: yes; FootprintName: R0805; ModelName: R0805
R105 = Резистор 100Ом 0,125Вт 1% [0805]: Contributor: jordanjin; Convert to PCB: yes; UniqueId: gge9e8368af3e05dccc; ModelId: de27d504f5024d53a3020ec2611f5e5e; Origin Footprint: R0805; Device: Резистор 100Ом 0,125Вт 1% [0805]; Symbol: Резистор 100Ом 0,125Вт 1% [0805]; Manufacturer Part: R0805; spicePre: R; spiceSymbolName: Резистор 12кОм 0,125Вт 1% [0805]; Add into BOM: yes; FootprintName: R0805; ModelName: R0805
R106 = Резистор 12кОм 0,125Вт 1% [0805]: Contributor: jordanjin; Convert to PCB: yes; UniqueId: gge6a20c8c131949399; ModelId: de27d504f5024d53a3020ec2611f5e5e; Origin Footprint: R0805; Device: Резистор 12кОм 0,125Вт 1% [0805]; Symbol: Резистор 12кОм 0,125Вт 1% [0805]; Manufacturer Part: R0805; spicePre: R; spiceSymbolName: Резистор 12кОм 0,125Вт 1% [0805]; Add into BOM: yes; FootprintName: R0805; ModelName: R0805
R107 = Резистор 100Ом 0,125Вт 1% [0805]: Contributor: jordanjin; Convert to PCB: yes; UniqueId: gge91e711025a308bb8; ModelId: de27d504f5024d53a3020ec2611f5e5e; Origin Footprint: R0805; Device: Резистор 100Ом 0,125Вт 1% [0805]; Symbol: Резистор 100Ом 0,125Вт 1% [0805]; Manufacturer Part: R0805; spicePre: R; spiceSymbolName: Резистор 12кОм 0,125Вт 1% [0805]; Add into BOM: yes; FootprintName: R0805; ModelName: R0805
R108 = Резистор 12кОм 0,125Вт 1% [0805]: Contributor: jordanjin; Convert to PCB: yes; UniqueId: ggeb50d050c0c15c8f5; ModelId: de27d504f5024d53a3020ec2611f5e5e; Origin Footprint: R0805; Device: Резистор 12кОм 0,125Вт 1% [0805]; Symbol: Резистор 12кОм 0,125Вт 1% [0805]; Manufacturer Part: R0805; spicePre: R; spiceSymbolName: Резистор 12кОм 0,125Вт 1% [0805]; Add into BOM: yes; FootprintName: R0805; ModelName: R0805
R109 = Резистор 100Ом 0,125Вт 1% [0805]: Contributor: jordanjin; Convert to PCB: yes; UniqueId: gge40888de84444f326; ModelId: de27d504f5024d53a3020ec2611f5e5e; Origin Footprint: R0805; Device: Резистор 100Ом 0,125Вт 1% [0805]; Symbol: Резистор 100Ом 0,125Вт 1% [0805]; Manufacturer Part: R0805; spicePre: R; spiceSymbolName: Резистор 12кОм 0,125Вт 1% [0805]; Add into BOM: yes; FootprintName: R0805; ModelName: R0805
R110 = Резистор 12кОм 0,125Вт 1% [0805]: Contributor: jordanjin; Convert to PCB: yes; UniqueId: gge5e816858bb71df28; ModelId: de27d504f5024d53a3020ec2611f5e5e; Origin Footprint: R0805; Device: Резистор 12кОм 0,125Вт 1% [0805]; Symbol: Резистор 12кОм 0,125Вт 1% [0805]; Manufacturer Part: R0805; spicePre: R; spiceSymbolName: Резистор 12кОм 0,125Вт 1% [0805]; Add into BOM: yes; FootprintName: R0805; ModelName: R0805
R111 = Резистор 100Ом 0,125Вт 1% [0805]: Contributor: jordanjin; Convert to PCB: yes; UniqueId: gge4668ab4809823d7c; ModelId: de27d504f5024d53a3020ec2611f5e5e; Origin Footprint: R0805; Device: Резистор 100Ом 0,125Вт 1% [0805]; Symbol: Резистор 100Ом 0,125Вт 1% [0805]; Manufacturer Part: R0805; spicePre: R; spiceSymbolName: Резистор 12кОм 0,125Вт 1% [0805]; Add into BOM: yes; FootprintName: R0805; ModelName: R0805
R112 = Резистор 12кОм 0,125Вт 1% [0805]: Contributor: jordanjin; Convert to PCB: yes; UniqueId: gge6d03b156add52f59; ModelId: de27d504f5024d53a3020ec2611f5e5e; Origin Footprint: R0805; Device: Резистор 12кОм 0,125Вт 1% [0805]; Symbol: Резистор 12кОм 0,125Вт 1% [0805]; Manufacturer Part: R0805; spicePre: R; spiceSymbolName: Резистор 12кОм 0,125Вт 1% [0805]; Add into BOM: yes; FootprintName: R0805; ModelName: R0805
R118 = Резистор 100Ом 0,125Вт 1% [0805]: Contributor: jordanjin; Convert to PCB: yes; UniqueId: gge07eaf7a8f1643a1b; ModelId: de27d504f5024d53a3020ec2611f5e5e; Origin Footprint: R0805; Device: Резистор 100Ом 0,125Вт 1% [0805]; Symbol: Резистор 100Ом 0,125Вт 1% [0805]; Manufacturer Part: R0805; spicePre: R; spiceSymbolName: Резистор 12кОм 0,125Вт 1% [0805]; Add into BOM: yes; FootprintName: R0805; ModelName: R0805
R119 = Резистор 100Ом 0,125Вт 1% [0805]: Contributor: jordanjin; Convert to PCB: yes; UniqueId: gge6de872c1c3061c0f; ModelId: de27d504f5024d53a3020ec2611f5e5e; Origin Footprint: R0805; Device: Резистор 100Ом 0,125Вт 1% [0805]; Symbol: Резистор 100Ом 0,125Вт 1% [0805]; Manufacturer Part: R0805; spicePre: R; spiceSymbolName: Резистор 12кОм 0,125Вт 1% [0805]; Add into BOM: yes; FootprintName: R0805; ModelName: R0805
R120 = Резистор 100Ом 0,125Вт 1% [0805]: Contributor: jordanjin; Convert to PCB: yes; UniqueId: gge98a8f3e179b6914a; ModelId: de27d504f5024d53a3020ec2611f5e5e; Origin Footprint: R0805; Device: Резистор 100Ом 0,125Вт 1% [0805]; Symbol: Резистор 100Ом 0,125Вт 1% [0805]; Manufacturer Part: R0805; spicePre: R; spiceSymbolName: Резистор 12кОм 0,125Вт 1% [0805]; Add into BOM: yes; FootprintName: R0805; ModelName: R0805
R121 = Резистор 100Ом 0,125Вт 1% [0805]: Contributor: jordanjin; Convert to PCB: yes; UniqueId: ggefbb83fafa60225a0; ModelId: de27d504f5024d53a3020ec2611f5e5e; Origin Footprint: R0805; Device: Резистор 100Ом 0,125Вт 1% [0805]; Symbol: Резистор 100Ом 0,125Вт 1% [0805]; Manufacturer Part: R0805; spicePre: R; spiceSymbolName: Резистор 12кОм 0,125Вт 1% [0805]; Add into BOM: yes; FootprintName: R0805; ModelName: R0805
R122 = Резистор 100Ом 0,125Вт 1% [0805]: Contributor: jordanjin; Convert to PCB: yes; UniqueId: gge47069d7b29d0598f; ModelId: de27d504f5024d53a3020ec2611f5e5e; Origin Footprint: R0805; Device: Резистор 100Ом 0,125Вт 1% [0805]; Symbol: Резистор 100Ом 0,125Вт 1% [0805]; Manufacturer Part: R0805; spicePre: R; spiceSymbolName: Резистор 12кОм 0,125Вт 1% [0805]; Add into BOM: yes; FootprintName: R0805; ModelName: R0805
R123 = Резистор 100Ом 0,125Вт 1% [0805]: Contributor: jordanjin; Convert to PCB: yes; UniqueId: gge0a68d2064838e57a; ModelId: de27d504f5024d53a3020ec2611f5e5e; Origin Footprint: R0805; Device: Резистор 100Ом 0,125Вт 1% [0805]; Symbol: Резистор 100Ом 0,125Вт 1% [0805]; Manufacturer Part: R0805; spicePre: R; spiceSymbolName: Резистор 12кОм 0,125Вт 1% [0805]; Add into BOM: yes; FootprintName: R0805; ModelName: R0805
R124 = Резистор 100Ом 0,125Вт 1% [0805]: Contributor: jordanjin; Convert to PCB: yes; UniqueId: gge2ad18ecfa8157ebd; ModelId: de27d504f5024d53a3020ec2611f5e5e; Origin Footprint: R0805; Device: Резистор 100Ом 0,125Вт 1% [0805]; Symbol: Резистор 100Ом 0,125Вт 1% [0805]; Manufacturer Part: R0805; spicePre: R; spiceSymbolName: Резистор 12кОм 0,125Вт 1% [0805]; Add into BOM: yes; FootprintName: R0805; ModelName: R0805
R125 = Резистор 100Ом 0,125Вт 1% [0805]: Contributor: jordanjin; Convert to PCB: yes; UniqueId: ggeed29cd528e8221e7; ModelId: de27d504f5024d53a3020ec2611f5e5e; Origin Footprint: R0805; Device: Резистор 100Ом 0,125Вт 1% [0805]; Symbol: Резистор 100Ом 0,125Вт 1% [0805]; Manufacturer Part: R0805; spicePre: R; spiceSymbolName: Резистор 12кОм 0,125Вт 1% [0805]; Add into BOM: yes; FootprintName: R0805; ModelName: R0805
VD102 = Светодиод FYLS-0805GC [0805]: Manufacturer: Ningbo Foryard Optoelectronics; Contributor: jordanjin; Convert to PCB: yes; UniqueId: ggeb9dbbd666b622848; Origin Footprint: FYLS-0805GC; Device: Светодиод FYLS-0805GC [0805]; Symbol: Светодиод FYLS-0805GC [0805]; Manufacturer Part: FYLS-0805GC; spicePre: V; spiceSymbolName: FYLS-0805GC; Add into BOM: yes
VD103 = Светодиод FYLS-0805GC [0805]: Manufacturer: Ningbo Foryard Optoelectronics; Contributor: jordanjin; Convert to PCB: yes; UniqueId: ggedbf1e97d50b40f59; Origin Footprint: FYLS-0805GC; Device: Светодиод FYLS-0805GC [0805]; Symbol: Светодиод FYLS-0805GC [0805]; Manufacturer Part: FYLS-0805GC; spicePre: V; spiceSymbolName: FYLS-0805GC; Add into BOM: yes
VD104 = Светодиод FYLS-0805GC [0805]: Manufacturer: Ningbo Foryard Optoelectronics; Contributor: jordanjin; Convert to PCB: yes; UniqueId: ggefd7f9cc88ba5af29; Origin Footprint: FYLS-0805GC; Device: Светодиод FYLS-0805GC [0805]; Symbol: Светодиод FYLS-0805GC [0805]; Manufacturer Part: FYLS-0805GC; spicePre: V; spiceSymbolName: FYLS-0805GC; Add into BOM: yes
VD105 = Светодиод FYLS-0805GC [0805]: Manufacturer: Ningbo Foryard Optoelectronics; Contributor: jordanjin; Convert to PCB: yes; UniqueId: gge69c4a475fa0f9d21; Origin Footprint: FYLS-0805GC; Device: Светодиод FYLS-0805GC [0805]; Symbol: Светодиод FYLS-0805GC [0805]; Manufacturer Part: FYLS-0805GC; spicePre: V; spiceSymbolName: FYLS-0805GC; Add into BOM: yes
VD106 = Светодиод FYLS-0805GC [0805]: Manufacturer: Ningbo Foryard Optoelectronics; Contributor: jordanjin; Convert to PCB: yes; UniqueId: gge2459f9207d57712e; Origin Footprint: FYLS-0805GC; Device: Светодиод FYLS-0805GC [0805]; Symbol: Светодиод FYLS-0805GC [0805]; Manufacturer Part: FYLS-0805GC; spicePre: V; spiceSymbolName: FYLS-0805GC; Add into BOM: yes
VD107 = Светодиод FYLS-0805GC [0805]: Manufacturer: Ningbo Foryard Optoelectronics; Contributor: jordanjin; Convert to PCB: yes; UniqueId: gge76ae14a4fa315c80; Origin Footprint: FYLS-0805GC; Device: Светодиод FYLS-0805GC [0805]; Symbol: Светодиод FYLS-0805GC [0805]; Manufacturer Part: FYLS-0805GC; spicePre: V; spiceSymbolName: FYLS-0805GC; Add into BOM: yes
VD108 = Светодиод FYLS-0805GC [0805]: Manufacturer: Ningbo Foryard Optoelectronics; Contributor: jordanjin; Convert to PCB: yes; UniqueId: gge23dfa43ba5af9ad1; Origin Footprint: FYLS-0805GC; Device: Светодиод FYLS-0805GC [0805]; Symbol: Светодиод FYLS-0805GC [0805]; Manufacturer Part: FYLS-0805GC; spicePre: V; spiceSymbolName: FYLS-0805GC; Add into BOM: yes
VD109 = Светодиод FYLS-0805GC [0805]: Manufacturer: Ningbo Foryard Optoelectronics; Contributor: jordanjin; Convert to PCB: yes; UniqueId: ggefc489dcc3785d6cb; Origin Footprint: FYLS-0805GC; Device: Светодиод FYLS-0805GC [0805]; Symbol: Светодиод FYLS-0805GC [0805]; Manufacturer Part: FYLS-0805GC; spicePre: V; spiceSymbolName: FYLS-0805GC; Add into BOM: yes
XP101 = Вилка на плату прямая BH2-20 (DS1014-20SF1B-B) 20pin шаг 2.00мм: Manufacturer: CONNFLY; Contributor: jordanjin; Convert to PCB: yes; UniqueId: ggeb4d4aa9e3e8a36bb; ModelId: 3146b565e2734c7388c693d0a43641ce; Origin Footprint: CONN-TH_20P-P2.00_DS1014-20SF1B; Device: Вилка на плату прямая BH2-20 (DS1014-20SF1B-B) 20pin шаг 2.00мм; Symbol: Вилка на плату прямая BH2-20 (DS1014-20SF1B-B) 20pin шаг 2.00мм; Supplier: LCSC; Supplier Part: C7498721; Manufacturer Part: BH2-20 (DS1014-20SF1B-B); JLCPCB Part Class: Extended Part; spicePre: X; spiceSymbolName: Вилка на плату прямая BH2-20 (DS1014-20SF1B-B) 20pin шаг 2.00мм; Add into BOM: yes; FootprintName: CONN-TH_20P-P2.00_DS1014-20SF1B; ModelName: CONN-TH_20P-P2.00_DS1014-20SF1B
XP102 = Вилка на плату прямая BH2-20 (DS1014-20SF1B-B) 20pin шаг 2.00мм: Manufacturer: CONNFLY; Contributor: jordanjin; Convert to PCB: yes; UniqueId: ggea69bf68db1b85ec2; ModelId: 3146b565e2734c7388c693d0a43641ce; Origin Footprint: CONN-TH_20P-P2.00_DS1014-20SF1B; Device: Вилка на плату прямая BH2-20 (DS1014-20SF1B-B) 20pin шаг 2.00мм; Symbol: Вилка на плату прямая BH2-20 (DS1014-20SF1B-B) 20pin шаг 2.00мм; Supplier: LCSC; Supplier Part: C7498721; Manufacturer Part: BH2-20 (DS1014-20SF1B-B); JLCPCB Part Class: Extended Part; spicePre: X; spiceSymbolName: Вилка на плату прямая BH2-20 (DS1014-20SF1B-B) 20pin шаг 2.00мм; Add into BOM: yes; FootprintName: CONN-TH_20P-P2.00_DS1014-20SF1B; ModelName: CONN-TH_20P-P2.00_DS1014-20SF1B

## Sheet УШЯИ.411618.029Э Э3 Лист 2.schdoc
size 420 x 297 mm; ApprovedBy: Володкевич; CheckedBy: Нестеров; Author: Ефименко; CompanyName: ОАО "МНИПИ"; DrawnBy: Ефименко; Engineer: Ефименко; Organization: ОАО "МНИПИ"; DocumentNumber: УШЯИ.411618.029Э; SheetNumber: 2; SheetTotal: 8
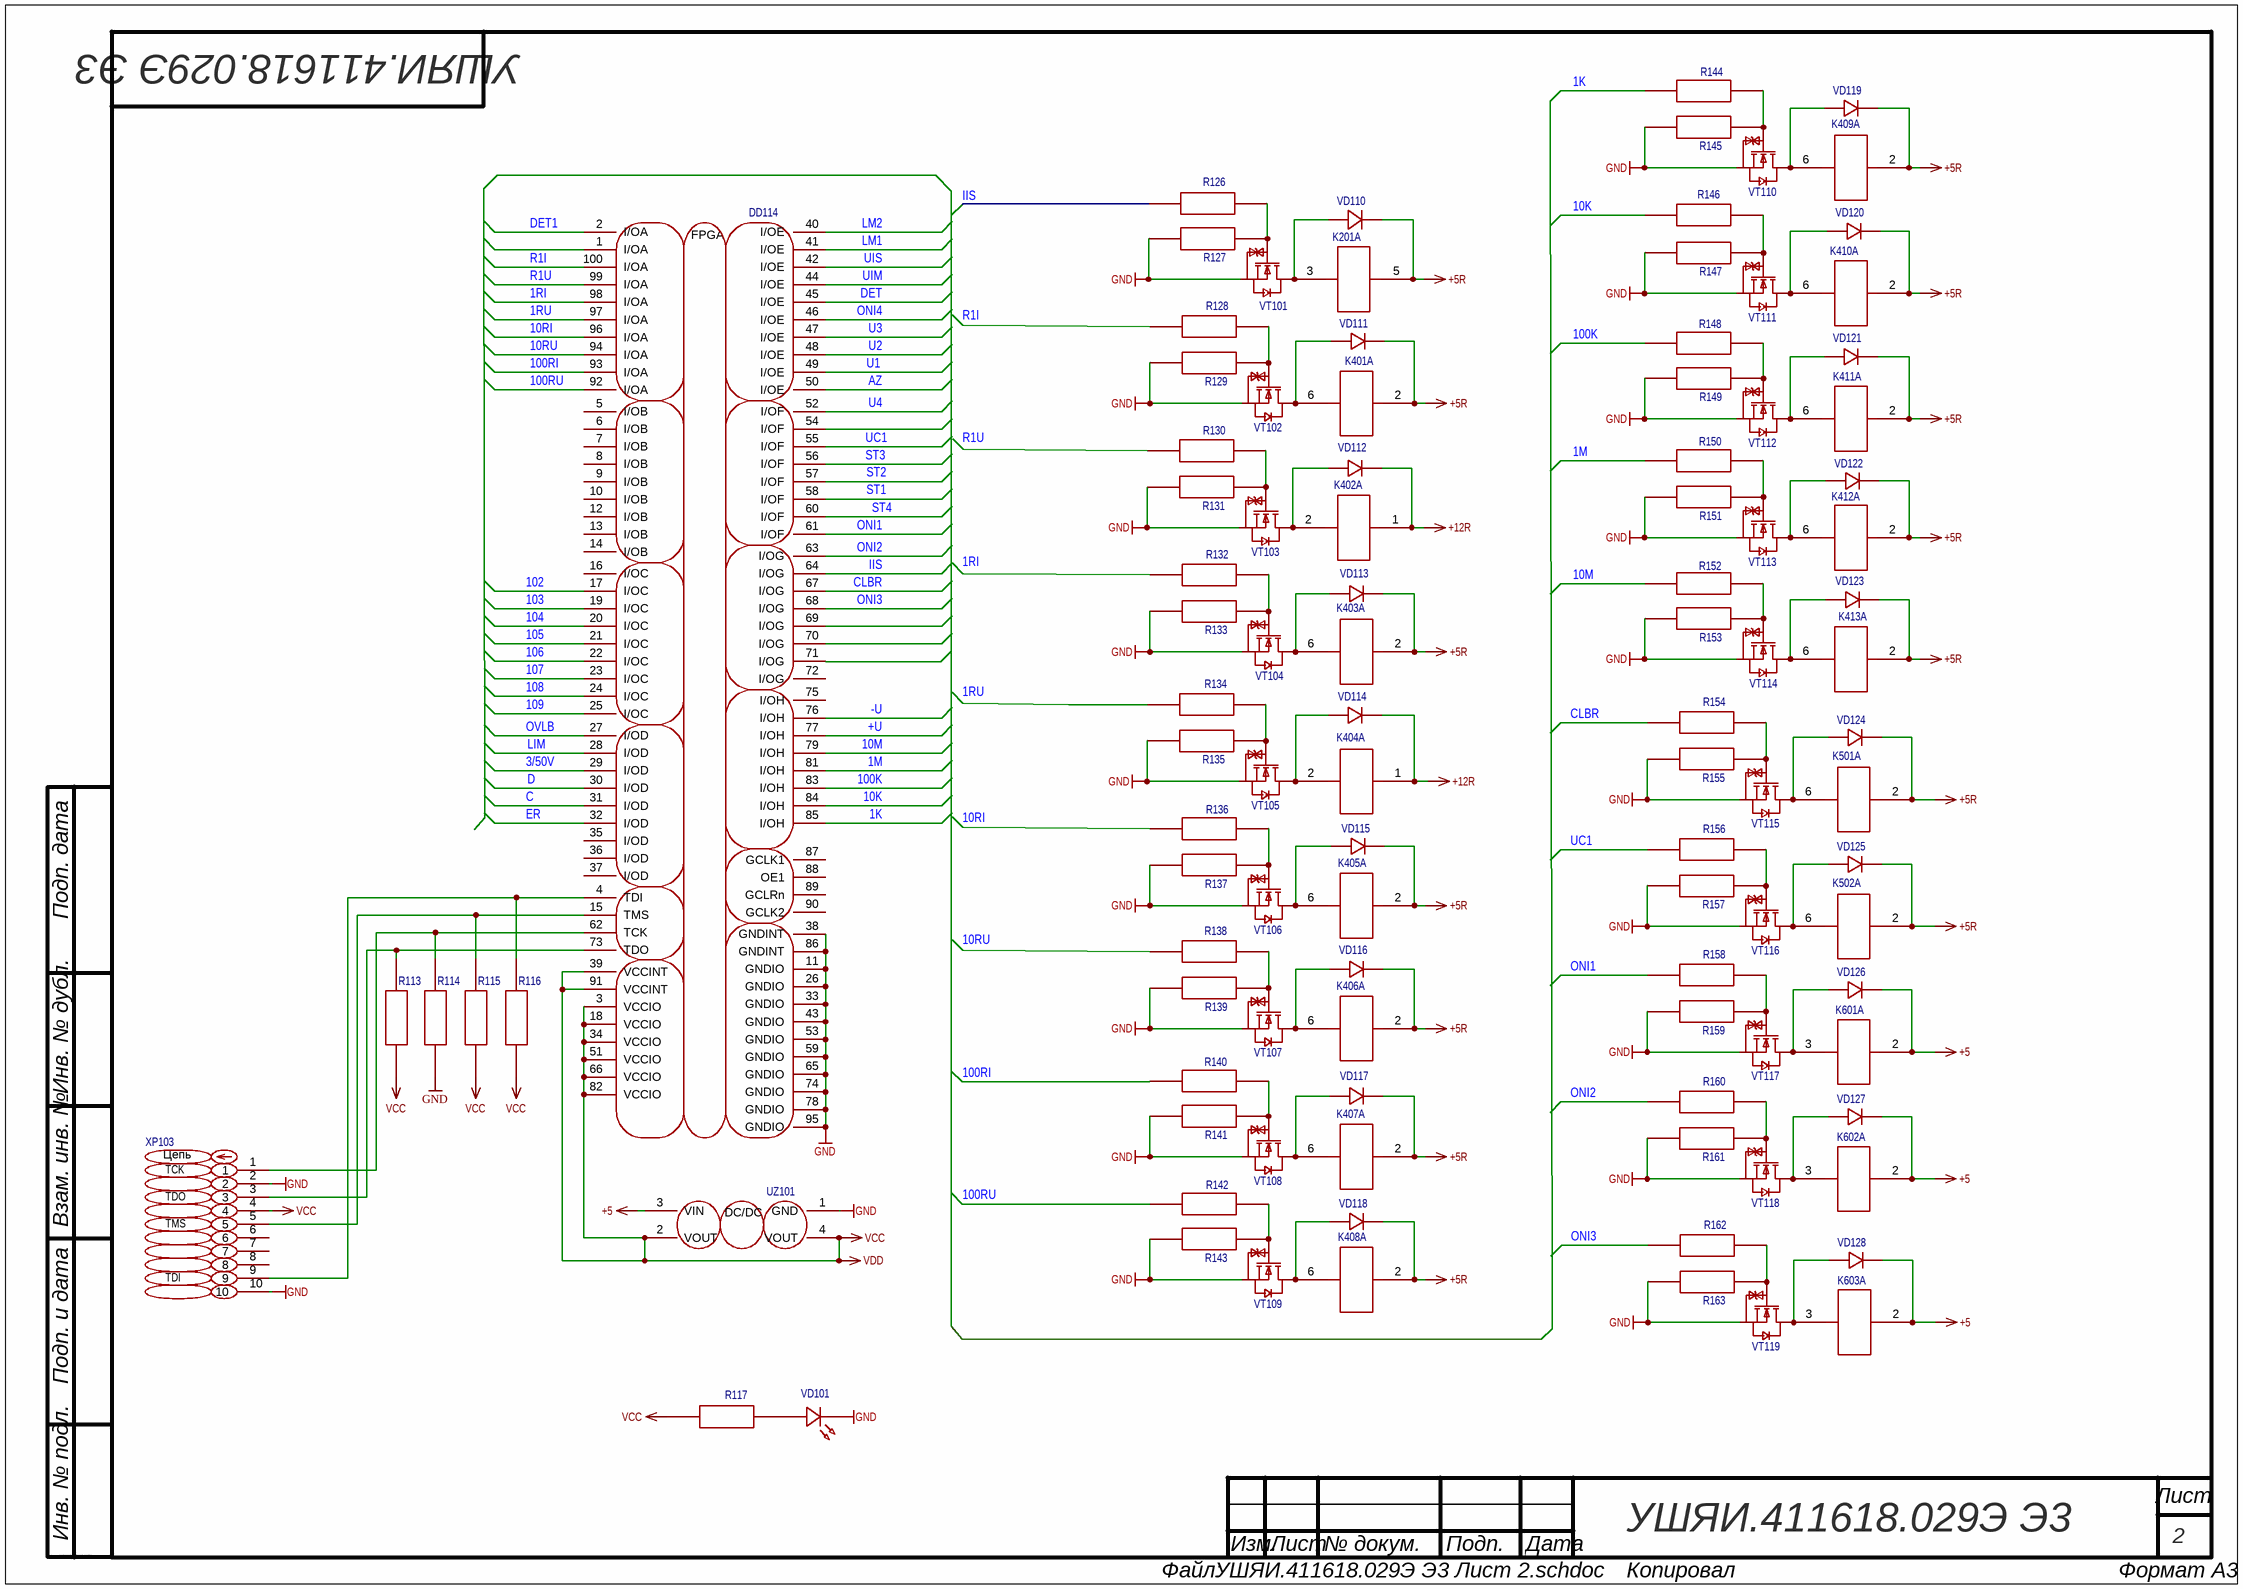
[diagram p1: УШЯИ.411618.029Э Э3 Лист 2.schdoc]